# EAGLE design RS232_NPN_PNP_Negative_FTDI (EAGLE 7.6.0)
RS232 Adapter using NPN and PNP Transistors
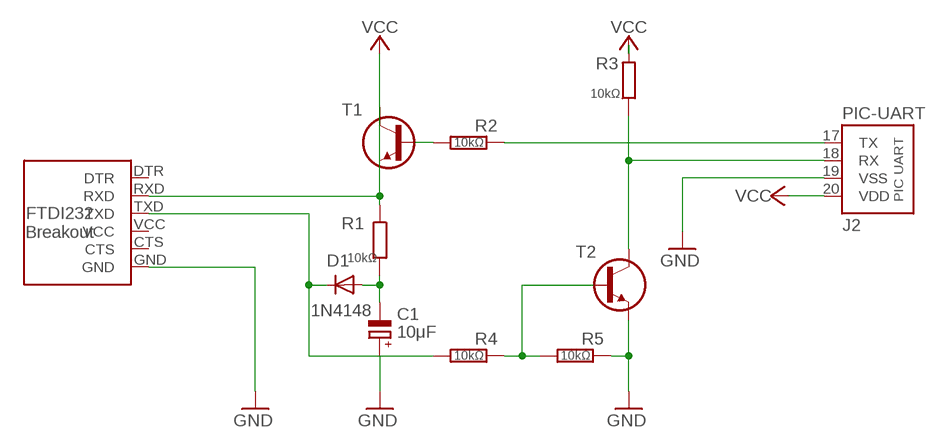
[diagram p0: schematic, sheet 1]

## Parts
C1  10μF  CPOLE2,5-5/V  [E2,5-5/V]
D1  1N4148  1N414834-5V  [DO34-5V]
J1  FTDI232-BO  [FTDI232-BO]
J2  PIC-UART  [PIC-UART]
R1  10kΩ  R0202/5-V  [0202/5-V]
R2  10kΩ  R0202/10-V  [0202/10-V]
R3  10kΩ  R0202/7-V  [0202/7-V]
R4  10kΩ  R0202/7  [0202/7]
R5  10kΩ  R0202/2V  [0202/2V]
T1  BC547CBE  [TO92-CBE]
T2  BC547CBE  [TO92-CBE]

## Nets
-12V: C1.- D1.A R1.2
GND: C1.+ J1.GND J2.19(VSS) R5.1 T2.E
N$1: R2.2 T1.B
N$6: R4.1 R5.2 T2.B
RX: J2.18(RX) R3.1 T2.C
RXD: J1.RXD R1.1 T1.C
TX: J2.17(TX) R2.1
TXD: D1.C J1.TXD R4.2
VCC: J2.20(VDD) R3.2 T1.E
Unconnected: J1.CTS J1.DTR J1.VCC

## Library data of the parts
C1 = c:CPOL: POLARIZED CAPACITOR, European symbol
D1 = d:1N4148
J1 = pinconn:FTDI232-BO
J2 = pinconn:PIC-UART
R1-R5 = r:R: RESISTOR, European symbol
T1 T2 = t:BC547

## Net classes
0 default: width 0.61 mm

## Board
RS232 Adapter using NPN and PNP Transistors
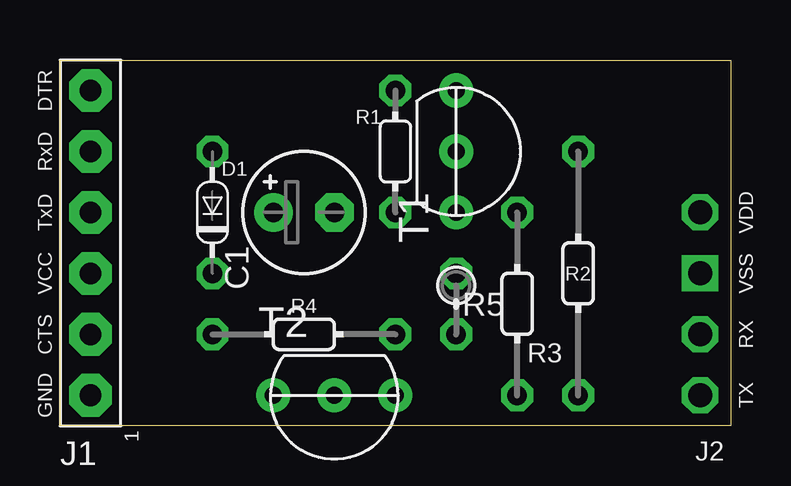
[diagram p1: board, top side]
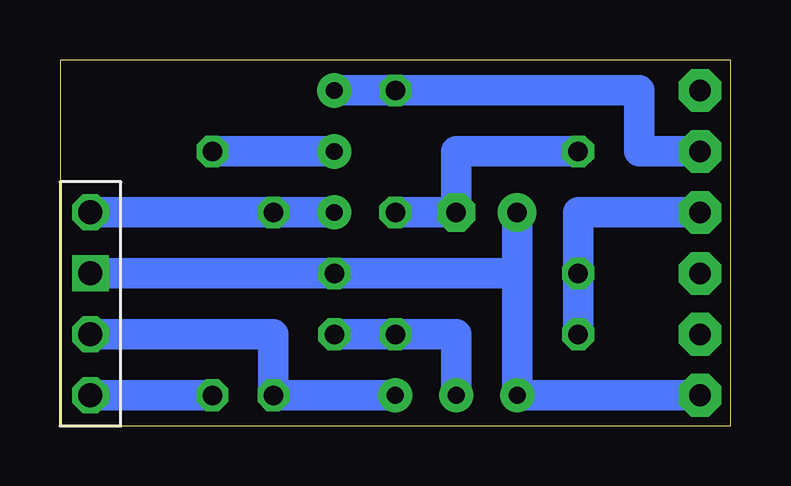
[diagram p2: board, bottom side, seen from below]

Size 27.94 x 15.24 mm. Coordinates in mm from the lower left corner, seen from the top.
Outline: 0,15.24 27.94,15.24 27.94,0 0,0 0,15.24
Copper layers (1*16): Top 0.035mm / dielectric 1.5mm / Bottom 0.035mm
Design rules "default": minimum track width 10mil, minimum drill 24mil, track to track 8mil, track to pad 8mil, pad to pad 8mil, via to via 8mil, smd to smd 8mil, copper to edge 40mil, drill to drill 8mil, minimum pad ring 10mil, minimum via ring 8mil, stop-mask expansion 4mil, vias tented up to drill 0mil, thermal gap 10mil

### Footprints (pad centres in the part's own frame; a part is rotated, then mirrored left to right if it is on the bottom)
E2,5-5/V = drill 0.813 pad 1.6: + 0,2.54 | drill 0.813 pad 1.6 octagon: - 0,0
DO34-5V = drill 0.813 octagon: A 0,2.54; C 0,-2.54
FTDI232-BO = drill 0.9 pad 1.778 octagon: CTS 0,-3.81; DTR 0,6.35; GND 0,-6.35; RXD 0,3.81; TXD 0,1.27; VCC 0,-1.27
PIC-UART = drill 1 octagon: 17 0,0; 18 0,2.54; 20 0,7.62 | drill 1 square: 19 0,5.08
0202/5-V = drill 0.813 octagon: 1 0,2.54; 2 0,-2.54
0202/10-V = drill 0.813 octagon: 1 0,-5.08; 2 0,5.08
0202/7-V = drill 0.813 octagon: 1 0,-3.81; 2 0,3.81
0202/7 = drill 0.813 octagon: 1 -3.81,0; 2 3.81,0
0202/2V = drill 0.813 octagon: 1 0,-1.27; 2 0,1.27
TO92-CBE = drill 0.7 pad 1.422: B 0,0; C 0,2.54; E 0,-2.54

### Placement (x,y rotation side)
C1  11.43,8.89 90 top
D1  6.35,8.89 0 top
J1  1.27,7.62 0 top
J2  26.67,1.27 0 top
R1  13.97,11.43 0 top
R2  21.59,6.35 0 top
R3  19.05,5.08 0 top
R4  10.16,3.81 180 top
R5  16.51,5.08 180 top
T1  16.51,11.43 0 top
T2  11.43,1.27 270 top

### Tracks (layer width: path | path; a pad name or v marks a point on that pad's centre or on a via)
-12V
  Bottom 1.27: D1.A 11.43,11.43 C1.- R1.2
GND
  Bottom 1.27: 8.89,6.35 R5.1 J2.19 | J1.GND T2.E 8.89,6.35 | 8.89,6.35 C1.+
N$1
  Bottom 1.27: R2.2 T1.B
N$6
  Bottom 1.27: T2.B 11.43,3.81 R4.1 R5.2
RX
  Bottom 1.27: J2.18 19.05,3.81 R3.1 T2.C
RXD
  Bottom 1.27: J1.RXD 3.81,11.43 3.81,13.97 R1.1 T1.C
TX
  Bottom 1.27: R2.1 J2.17
TXD
  Bottom 1.27: R4.2 D1.C 6.35,8.89 J1.TXD
VCC
  Bottom 1.27: T1.E R3.2 J2.20